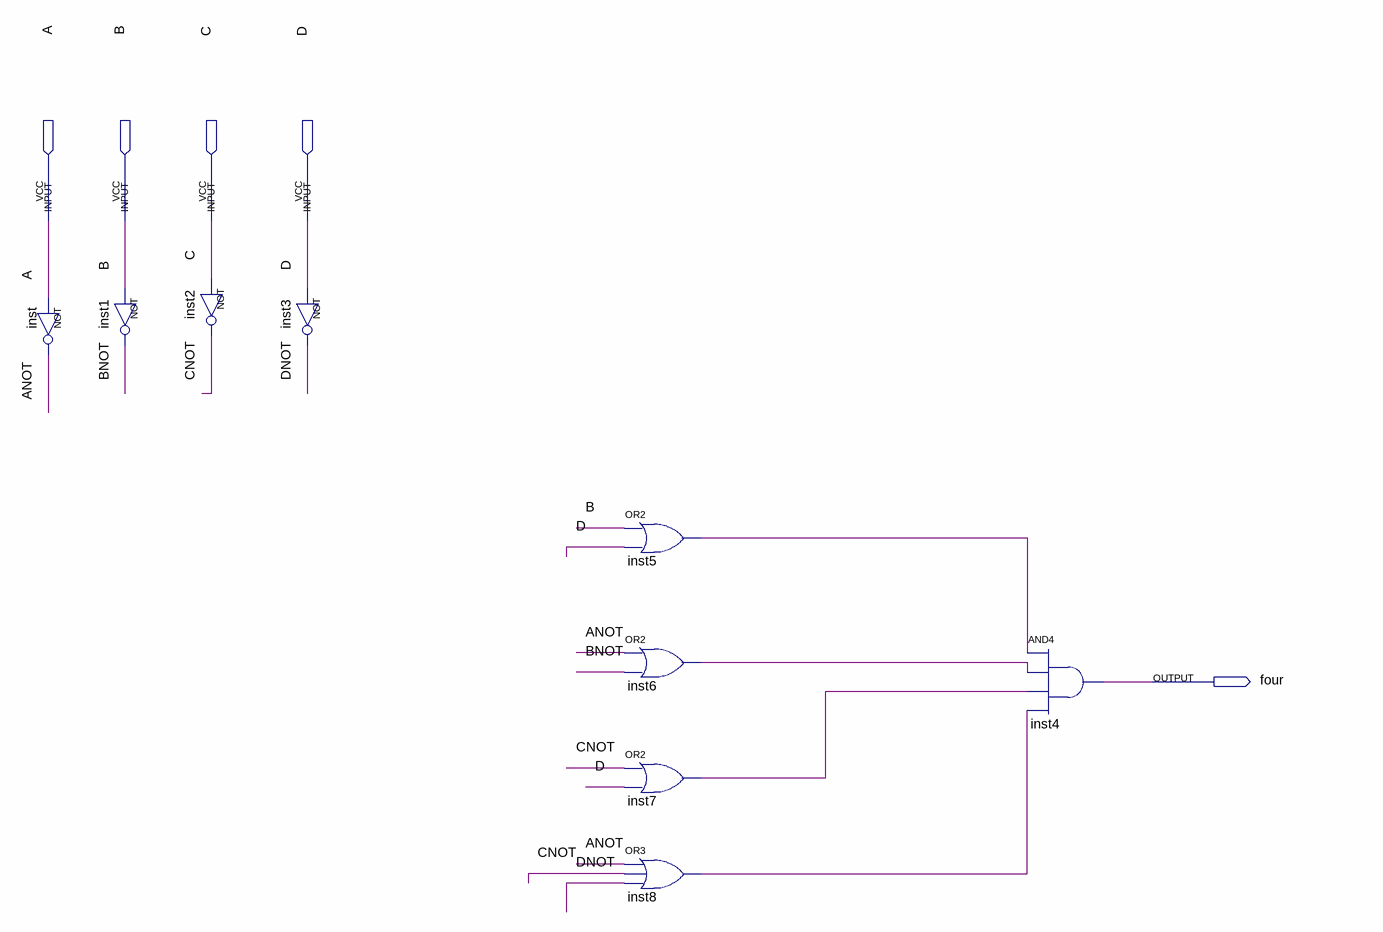
[diagram p0: schematic sheet]
// Quartus schematic output4.bdf as structural Verilog: 9 symbols, 5 pins
module output4 (
  input  A,
  input  B,
  input  C,
  input  D,
  output four
);

  wire ANOT, BNOT, CNOT, DNOT, inst5_out, inst6_out, inst7_out, inst8_out;

  not inst (ANOT, A);
  not inst1 (BNOT, B);
  not inst2 (CNOT, C);
  not inst3 (DNOT, D);
  or inst5 (inst5_out, B, D);
  or inst6 (inst6_out, ANOT, BNOT);
  or inst7 (inst7_out, CNOT, D);
  or inst8 (inst8_out, ANOT, CNOT, DNOT);
  and inst4 (four, inst5_out, inst6_out, inst7_out, inst8_out);
endmodule
